# Altium schematic sheet LED_Connectors.SchDoc: Connectors
size A; Author: Sam Tomlinson; SheetNumber: 2; SheetTotal: 6; ProjectTitle: LED Board; TeamLead: John Ulm
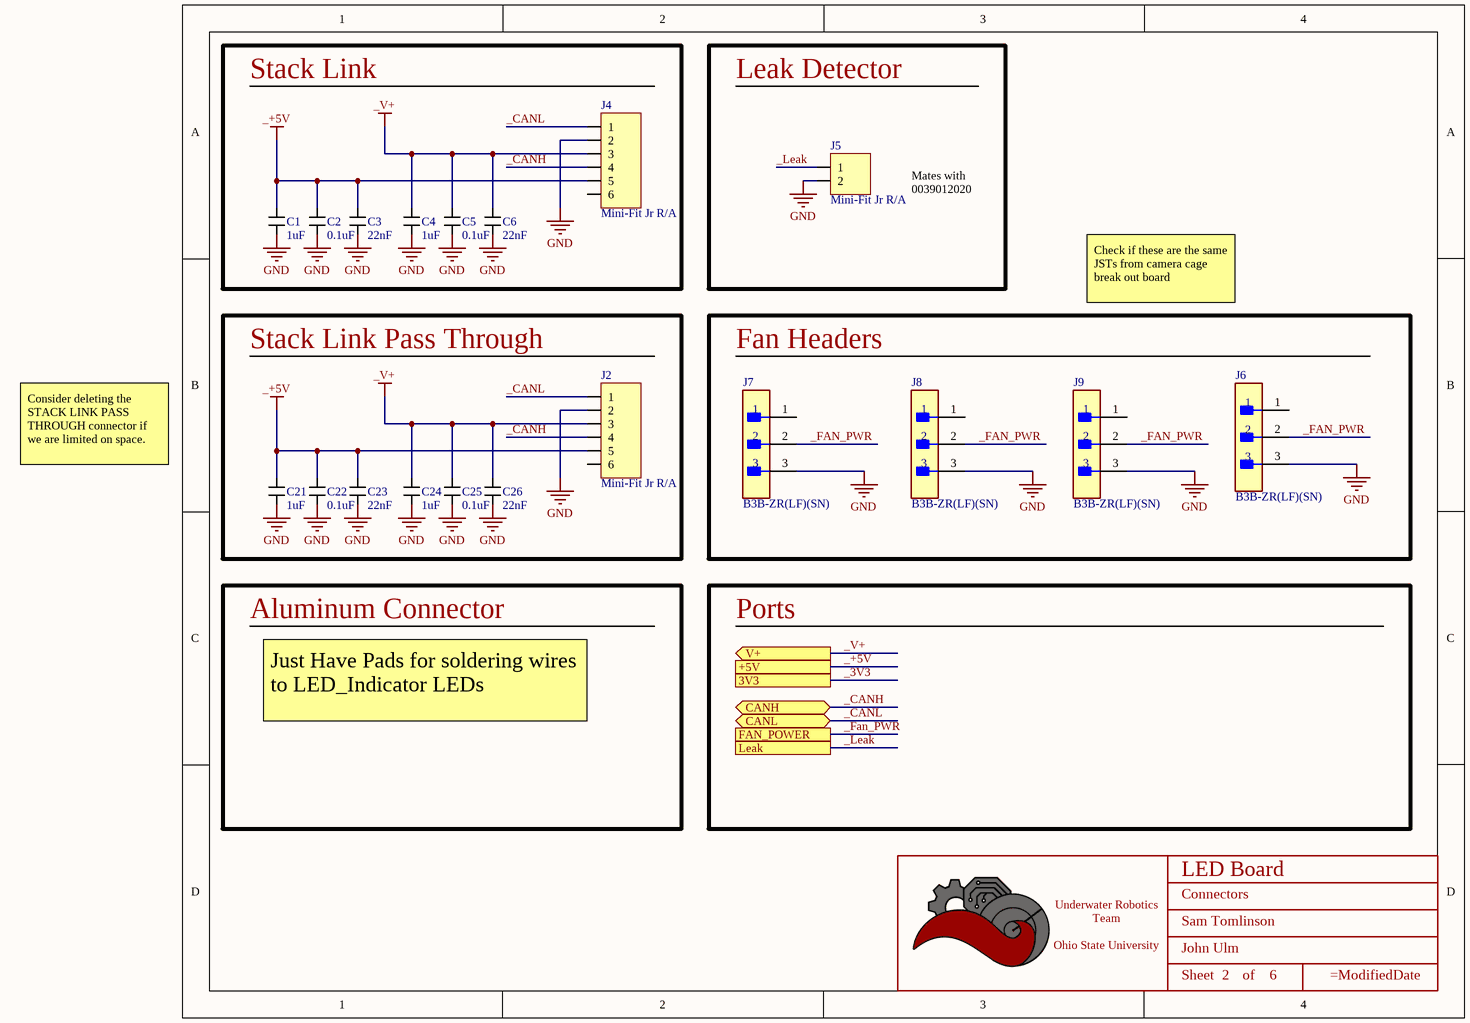
[diagram p0: LED_Connectors.SchDoc]

## Parts
*  Title_Block  [LOGO]  (value not drawn)  (graphical)
C1  value 1uF  [CAPACITOR_0603]  (hidden comment: 1uF Ceramic 16V)
C2  value 0.1uF  [CAPACITOR_0805]  (hidden comment: 100nF Ceramic 50V)
C3  value 22nF  [CAPACITOR_0402]  (hidden comment: 22nF Ceramic 25V)
C4  value 1uF  [CAPACITOR_0603]  (hidden comment: 1uF Ceramic 16V)
C5  value 0.1uF  [CAPACITOR_0805]  (hidden comment: 100nF Ceramic 50V)
C6  value 22nF  [CAPACITOR_0402]  (hidden comment: 22nF Ceramic 25V)
C21  value 1uF  [CAPACITOR_0603]  (hidden comment: 1uF Ceramic 16V)
C22  value 0.1uF  [CAPACITOR_0805]  (hidden comment: 100nF Ceramic 50V)
C23  value 22nF  [CAPACITOR_0402]  (hidden comment: 22nF Ceramic 25V)
C24  value 1uF  [CAPACITOR_0603]  (hidden comment: 1uF Ceramic 16V)
C25  value 0.1uF  [CAPACITOR_0805]  (hidden comment: 100nF Ceramic 50V)
C26  value 22nF  [CAPACITOR_0402]  (hidden comment: 22nF Ceramic 25V)
J2  Mini-Fit Jr R/A  [CONN_MOLEX_MINIFIT JR_6 POS_R/A]
J4  Mini-Fit Jr R/A  [CONN_MOLEX_MINIFIT JR_6 POS_R/A]
J5  Mini-Fit Jr R/A  [CONN_MOLEX_MINIFIT JR_2 POS_R/A]
J6  B3B-ZR(LF)(SN)  [FP-B3B-ZR_LF_SN-MFG]
J7  B3B-ZR(LF)(SN)  [FP-B3B-ZR_LF_SN-MFG]
J8  B3B-ZR(LF)(SN)  [FP-B3B-ZR_LF_SN-MFG]
J9  B3B-ZR(LF)(SN)  [FP-B3B-ZR_LF_SN-MFG]

## Blocks framed on the sheet
Stack Link: C1-C6 J4
Leak Detector: J5
Stack Link Pass Through: C21-C26 J2
Fan Headers: J6-J9

## Ports
3V3, +5V, CANH (bidir), CANL (bidir), FAN_POWER, Leak, V+ (out)

## Nets
_+5V: C1.1 C2.1 C3.1 C21.1 C22.1 C23.1 J2.5 J4.5 ; port +5V
_V+: C4.1 C5.1 C6.1 C24.1 C25.1 C26.1 J2.3 J4.3 ; port V+
GND: C1.2 C2.2 C3.2 C4.2 C5.2 C6.2 C21.2 C22.2 C23.2 C24.2 C25.2 C26.2 J2.2 J4.2 J5.2 J6.3 J7.3 J8.3 J9.3
_3V3: port 3V3
_CANH: J2.4 J4.4 ; port CANH
_CANL: J2.1 J4.1 ; port CANL
_Fan_PWR: J6.2 J7.2 J8.2 J9.2 ; port FAN_POWER
_Leak: J5.1 ; port Leak

Not connected (* = marked no-connect by the designer): J2 6; J4 6; J6 1; J7 1; J8 1; J9 1

## Notes on the sheet
- Mates with
  0039012020
- Check if these are the same JSTs from camera cage break out board
- Consider deleting the STACK LINK PASS THROUGH connector if we are limited on space.
- Aluminum Connector
- Ports
- Just Have Pads for soldering wires to LED_Indicator LEDs
- (in symbol Title_Block) Underwater Robotics Team / Ohio State University; Sheet; of

## Library data of the parts
* = Title_Block: UWRT Schematic Title Block Template / Created June 2021, Dylan Trainor
C1 C4 C21 C24 = CAPACITOR_1uF_0603: Cap 1uF 16V +/-10% / Ceramic 0603; Made By: Flip B; Tolerance: +/- 10%; Voltage: 16V; Supplier 1: Digi-Key; Supplier Part Number 1: 399-7847-1-ND
C2 C5 C22 C25 = CAPACITOR_0.1uF_0805: Cap 100nF 50V +/-10% / Ceramic 0805; Made By: Robert Pafford; Tolerance: +/- 10%; Voltage: 50V; Supplier 1: Newark; Supplier Part Number 1: 38AH3645
C3 C6 C23 C26 = CAPACITOR_0.022uF_0402: Cap 22nF 25V +/-10% / Ceramic 0402; Made By: Robert Pafford; Tolerance: +/- 10%; Voltage: 25V; Supplier 1: Digi-Key; Supplier Part Number 1: 445-1261-1-ND
J2 J4 = CONN_MOLEX_MINIFIT JR_6POS_R/A: Molex Minifit Jr. 5569 / 6 Pos R/A Natural; Pitch: 4.2mm; Configuration: Right Angle; Current Per Pin: 13A; Number of Positions: 8; Manufacturer: Molex; Color: Natural; Created By: Flip B; ComponentLink1Description: Datasheet; ComponentLink1URL: https://www.molex.com/pdm_docs/ps/PS-5556-001.pdf; Series: Minifit Jr 5569; Supplier 1: Digi-Key; Supplier Part Number 1: WM1353-ND
J5 = CONN_MOLEX_MINIFIT JR_2POS_R/A: Molex Minifit Jr. 5569 / 2 Pos R/A Natural; Pitch: 4.2mm; Configuration: Right Angle; Current Per Pin: 13A; Number of Positions: 2; Manufacturer: Molex; Color: Natural; Created By: Robert P; ComponentLink1Description: Datasheet; ComponentLink1URL: https://www.molex.com/pdm_docs/sd/026013115_sd.pdf; Series: Minifit Jr 5569; Supplier 1: Digi-Key; Supplier Part Number 1: WM1351-ND
J6-J9 = CMP-17439-000041-1: CONN HEADER VERT 3POS 1.5MM; Gender: Male; Max Voltage Rating (AC): 50V; Body Plating: Tin; Panel Thickness: 3.5mm; Number of Contacts: 3; Connector Type: Male Pin; Max Current Rating: 1A; Insulation Resistance: 500MR; Contact Resistance: 30mR; Pitch: 1.5mm; Lead Pitch: 1.5mm; Termination: Solder; Material: Nylon; Depth: 3.5mm; Min Operating Temperature: -25°C; Voltage Rating (DC): 50V; Number of Positions: 3; Voltage Rating (AC): 50V; Contact Plating: Tin; Housing Material: Polyamide; Mount: Through Hole; Number of Rows: 1; Series: ZH; Lead Free: Lead Free; Flammability Rating: UL94 V-0; Housing Color: Beige; REACH SVHC: No SVHC; Current Rating: 1A; Contact Type: Male Pin; Orientation: Straight; Voltage Rating: 50V; Packaging: Bulk; Color: Natural; Length: 6mm; Contact Material: Copper; Max Operating Temperature: 85°C; Fastening Type: Detent; Contact Mating Length: 0.094inch